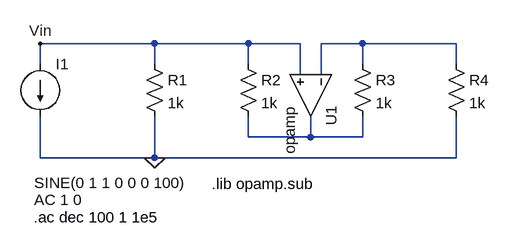
[diagram p0: schematic sim.asc]
sim.asc, the LTspice schematic file:
Version 4
SHEET 1 880 680
WIRE 80 80 -96 80
WIRE 224 80 80 80
WIRE 304 80 224 80
WIRE 400 80 336 80
WIRE 544 80 400 80
WIRE -96 112 -96 80
WIRE 80 112 80 80
WIRE 224 112 224 80
WIRE 400 112 400 80
WIRE 544 112 544 80
WIRE 304 128 304 80
WIRE 336 128 336 80
WIRE 224 224 224 192
WIRE 320 224 320 192
WIRE 320 224 224 224
WIRE 400 224 400 192
WIRE 400 224 320 224
WIRE -96 256 -96 192
WIRE 80 256 80 192
WIRE 80 256 -96 256
WIRE 544 256 544 192
WIRE 544 256 80 256
FLAG 80 256 0
FLAG -96 80 Vin
SYMBOL res 64 96 R0
SYMATTR InstName R1
SYMATTR Value 1k
SYMBOL res 208 96 R0
SYMATTR InstName R2
SYMATTR Value 1k
SYMBOL res 384 96 R0
SYMATTR InstName R3
SYMATTR Value 1k
SYMBOL res 528 96 R0
SYMATTR InstName R4
SYMATTR Value 1k
SYMBOL current -96 112 R0
WINDOW 3 -9 183 Left 2
WINDOW 123 -9 209 Left 2
WINDOW 39 0 0 Left 0
SYMATTR InstName I1
SYMATTR Value SINE(0 1 1 0 0 0 100)
SYMATTR Value2 AC 1 0
SYMBOL Opamps\\opamp 384 160 R90
SYMATTR InstName U1
SYMATTR SpiceLine Aol=1000K
SYMATTR SpiceLine2 GBW=100Meg
TEXT -106 348 Left 2 !.ac dec 100 1 1e5
TEXT 168 296 Left 2 !.lib opamp.sub

The netlist it stands for:
* sim.asc
R1 Vin 0 1k
R2 Vin N002 1k
R3 N001 N002 1k
R4 N001 0 1k
I1 Vin 0 SINE(0 1 1 0 0 0 100) AC 1 0
XU1 N001 Vin N002 opamp Aol=1000K GBW=100Meg  ; pins invin noninvin out
.ac dec 100 1 1e5
.lib opamp.sub
.backanno
.end